# EAGLE design TDR-head (EAGLE 9.5.0)
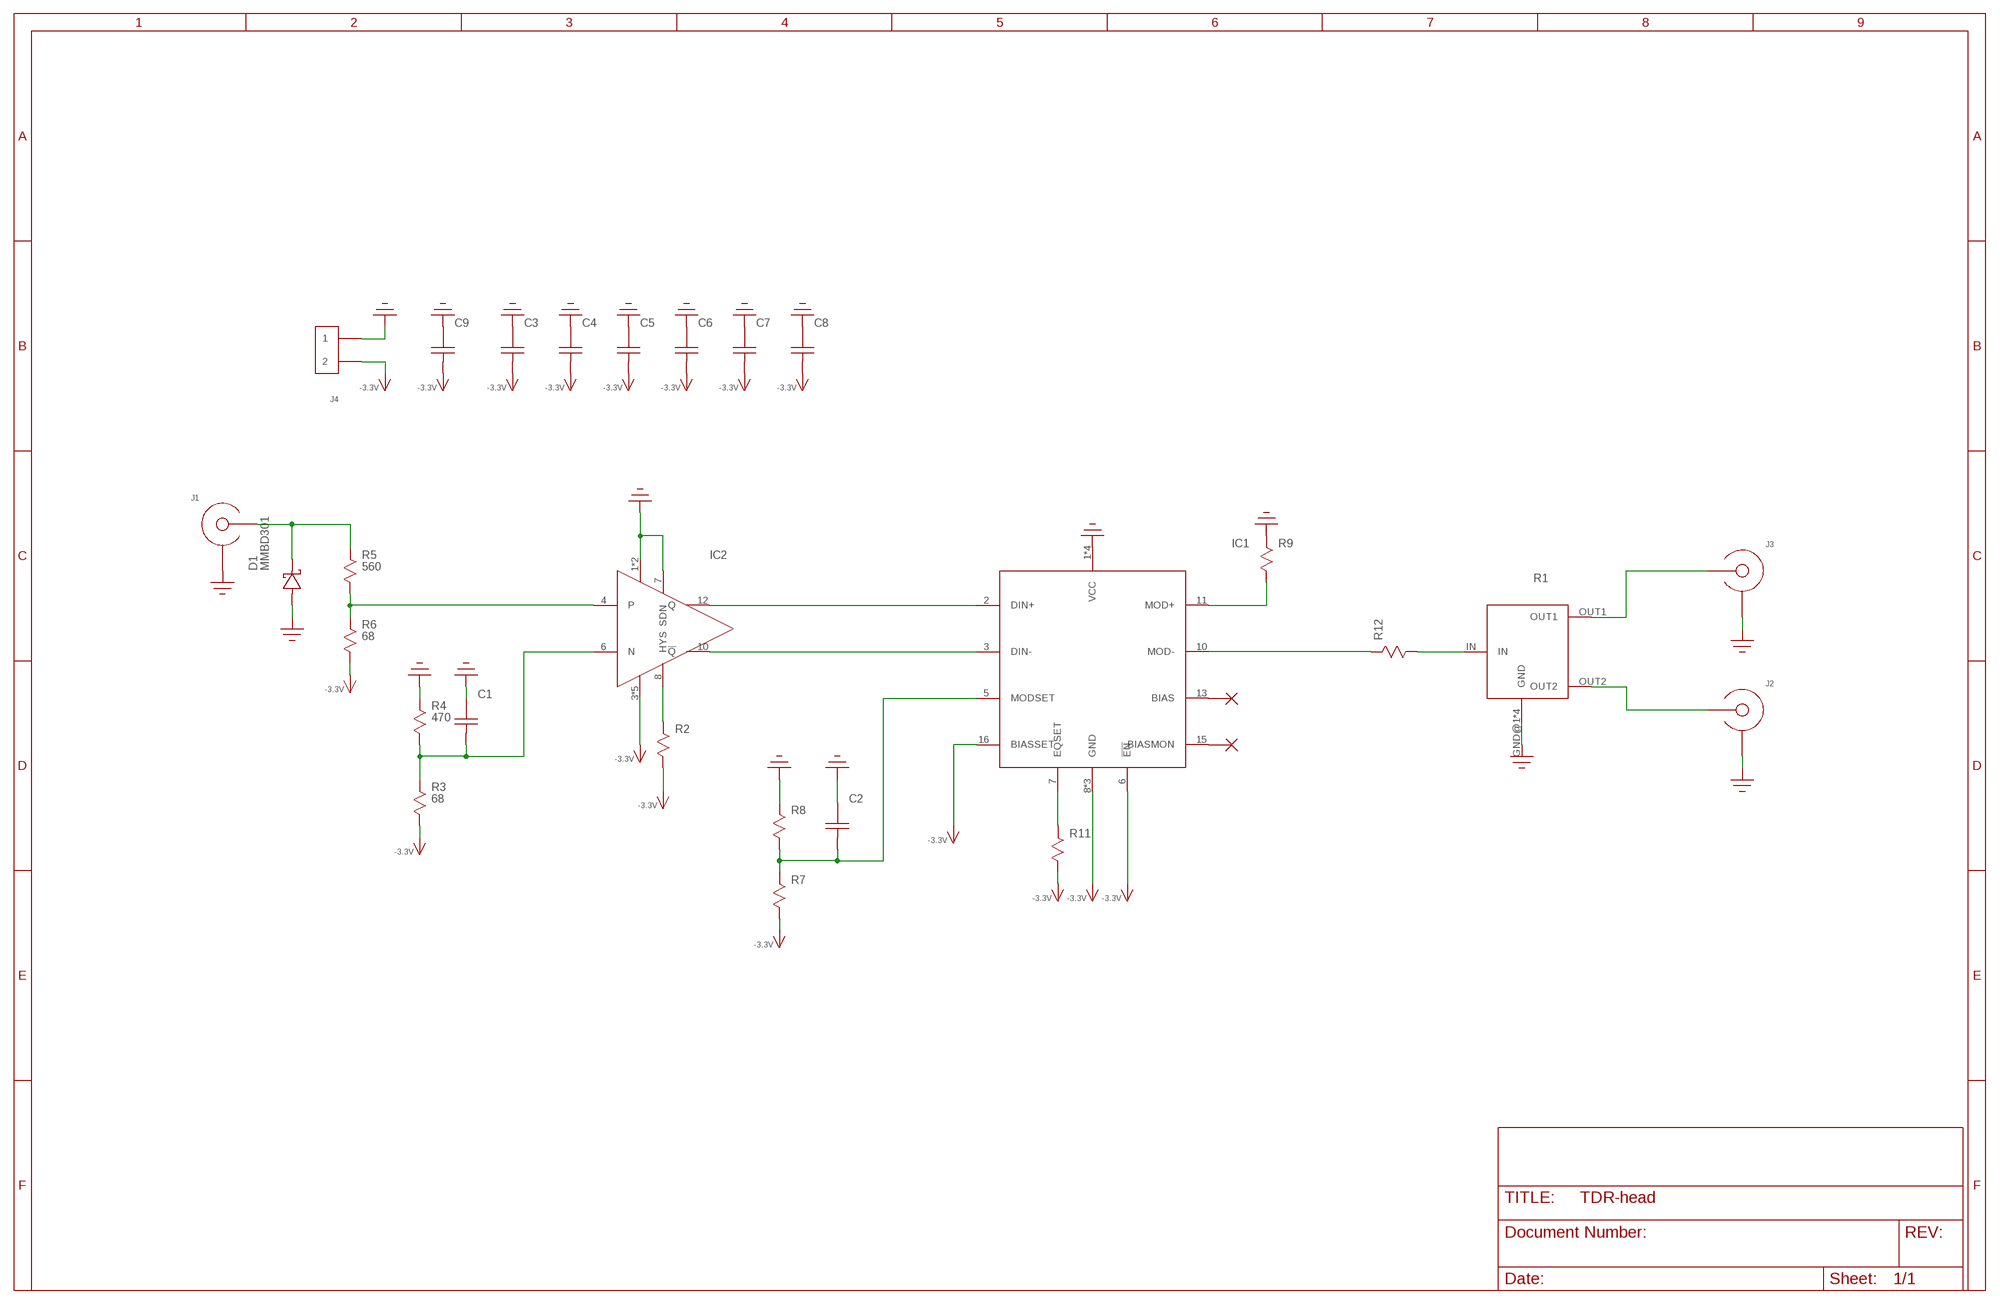
[diagram p0: schematic, sheet 1]

## Parts
C1  C0603  [C0603]
C2  C0603  [C0603]
C3  C  [C0402]
C4  C  [C0402]
C5  C  [C0402]
C6  C  [C0402]
C7  C  [C0402]
C8  C  [C0402]
C9  C1206  [1206]
D1  MMBD301  SCHOTTKYSOT-23  [SOT-23]
IC1  SY88022AL  [TQFN16-EP]
IC2  ADCMP607  [QFN12-3X3]
J1  SMA-EDGE-LAUNCH4020N5  [SMA_EDGE_LAUNCH_4L_4020_N5]
J2  SMA-EDGE-LAUNCH4020N5  [SMA_EDGE_LAUNCH_4L_4020_N5]
J3  SMA-EDGE-LAUNCH4020N5  [SMA_EDGE_LAUNCH_4L_4020_N5]
J4  HEADER_2PIN  [HEADER_2PIN]
R1  PS2012G-SPLITTER  [PS2012G-SPLITTER]
R2  R0603  [R0603]
R3  68  R0603  [R0603]
R4  470  R0603  [R0603]
R5  560  R0603  [R0603]
R6  68  R0603  [R0603]
R7  R0603  [R0603]
R8  R0603  [R0603]
R9  R0402  [0402]
R11  R0603  [R0603]
R12  R0402  [0402]
U$19  NO_CONNECT  (no package)
U$20  NO_CONNECT  (no package)

## Nets
-3.3V: C3.1 C4.1 C5.1 C6.1 C7.1 C8.1 C9.P$1 IC1.6(!EN!) IC1.8(GND) IC1.14(GND) IC1.16(BIASSET) IC1.EP(GND) IC2.3(VEE) IC2.5(VEE) IC2.9(VEE) IC2.11(VEE) IC2.EP(VEE) J4.2 R2.P$2 R3.P$2 R6.P$2 R7.P$2 R11.P$2
GND: C1.P$2 C2.P$2 C3.2 C4.2 C5.2 C6.2 C7.2 C8.2 C9.P$2 D1.1(ANODE) IC1.1(VCC) IC1.4(VCC) IC1.9(VCC) IC1.12(VCC) IC2.1(VCC) IC2.2(VCC) IC2.7(SDN) J1.BOTTOM_GND(SHIELD) J1.GND@1(SHIELD) J1.GND@2(SHIELD) J1.GND@3(SHIELD) J1.GND@4(SHIELD) J1.GND@5(SHIELD) J1.GND@6(SHIELD) J1.GND@7(SHIELD) J1.GND@8(SHIELD) J1.GND@9(SHIELD) J1.GND@10(SHIELD) J1.GND@14(SHIELD) J1.GND@15(SHIELD) J1.GND@16(SHIELD) J1.GND@17(SHIELD) J1.GND_PAD1(SHIELD) J1.GND_PAD2(SHIELD) J1.P$1(SHIELD) J1.P$2(SHIELD) J1.P$3(SHIELD) J1.P$4(SHIELD) J1.P$5(SHIELD) J2.BOTTOM_GND(SHIELD) J2.GND@1(SHIELD) J2.GND@2(SHIELD) J2.GND@3(SHIELD) J2.GND@4(SHIELD) J2.GND@5(SHIELD) J2.GND@6(SHIELD) J2.GND@7(SHIELD) J2.GND@8(SHIELD) J2.GND@9(SHIELD) J2.GND@10(SHIELD) J2.GND@14(SHIELD) J2.GND@15(SHIELD) J2.GND@16(SHIELD) J2.GND@17(SHIELD) J2.GND_PAD1(SHIELD) J2.GND_PAD2(SHIELD) J2.P$1(SHIELD) J2.P$2(SHIELD) J2.P$3(SHIELD) J2.P$4(SHIELD) J2.P$5(SHIELD) J3.BOTTOM_GND(SHIELD) J3.GND@1(SHIELD) J3.GND@2(SHIELD) J3.GND@3(SHIELD) J3.GND@4(SHIELD) J3.GND@5(SHIELD) J3.GND@6(SHIELD) J3.GND@7(SHIELD) J3.GND@8(SHIELD) J3.GND@9(SHIELD) J3.GND@10(SHIELD) J3.GND@14(SHIELD) J3.GND@15(SHIELD) J3.GND@16(SHIELD) J3.GND@17(SHIELD) J3.GND_PAD1(SHIELD) J3.GND_PAD2(SHIELD) J3.P$1(SHIELD) J3.P$2(SHIELD) J3.P$3(SHIELD) J3.P$4(SHIELD) J3.P$5(SHIELD) J4.1 R1.GND@1(GND) R1.GND@2(GND) R1.GND@3(GND) R1.GND@4(GND) R4.P$1 R8.P$1 R9.1
N$1: J2.CENTER@1(CENTER) J2.CENTER@2(CENTER) R1.OUT2
N$2: J3.CENTER@1(CENTER) J3.CENTER@2(CENTER) R1.OUT1
N$3: IC1.2(DIN+) IC2.12(Q)
N$4: IC1.3(DIN-) IC2.10(!Q!)
N$5: IC2.8(HYS) R2.P$1
N$6: C1.P$1 IC2.6(N) R3.P$1 R4.P$2
N$7 [13.4-6]: D1.3(CATHODE) J1.CENTER@1(CENTER) J1.CENTER@2(CENTER) R5.P$1
N$8 [13.4-6]: IC2.4(P) R5.P$2 R6.P$1
N$9: C2.P$1 IC1.5(MODSET) R7.P$1 R8.P$2
N$10 [13.4-6]: R1.IN R12.2
N$11: IC1.15(BIASMON) U$19.P$1
N$12: IC1.13(BIAS) U$20.P$1
N$13: IC1.11(MOD+) R9.2
N$14: IC1.7(EQSET) R11.P$1
N$15: IC1.10(MOD-) R12.1

## Library data of the parts
C1-C9 = yapo:C
D1 = yapo:SCHOTTKY
IC1 = yapo:SY88022AL
IC2 = yapo:ADCMP607
J1-J3 = sma-temp:SMA-EDGE-LAUNCH
J4 = yapo:HEADER_2PIN
R1 = yapo:PS2012G-SPLITTER
R2-R9 R11 R12 = yapo:R
U$19 U$20 = yapo:NO_CONNECT

## Net classes
1 13.4-6: width 0.34 mm, clearance 0.152 mm

## Board
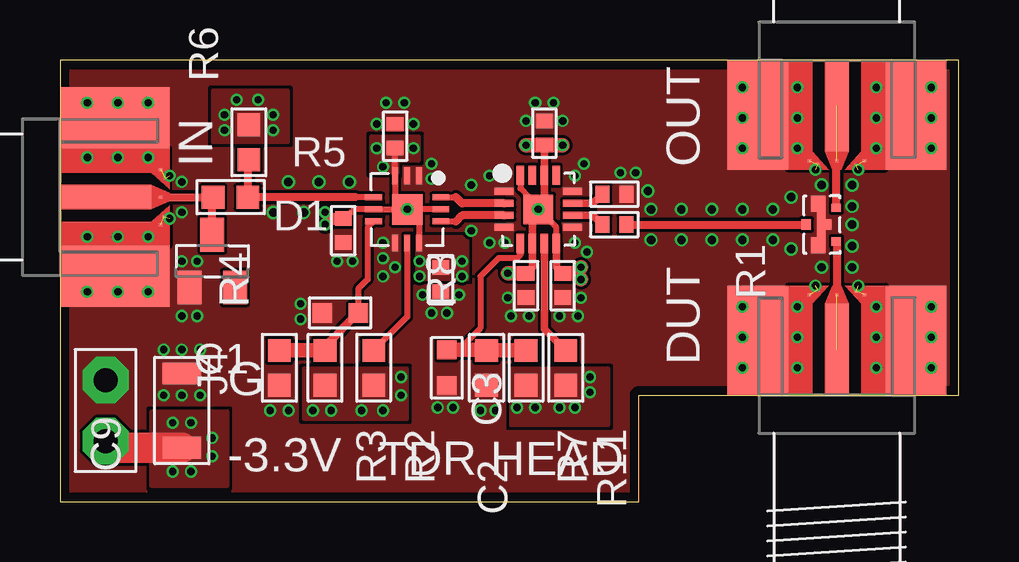
[diagram p1: board, top side]
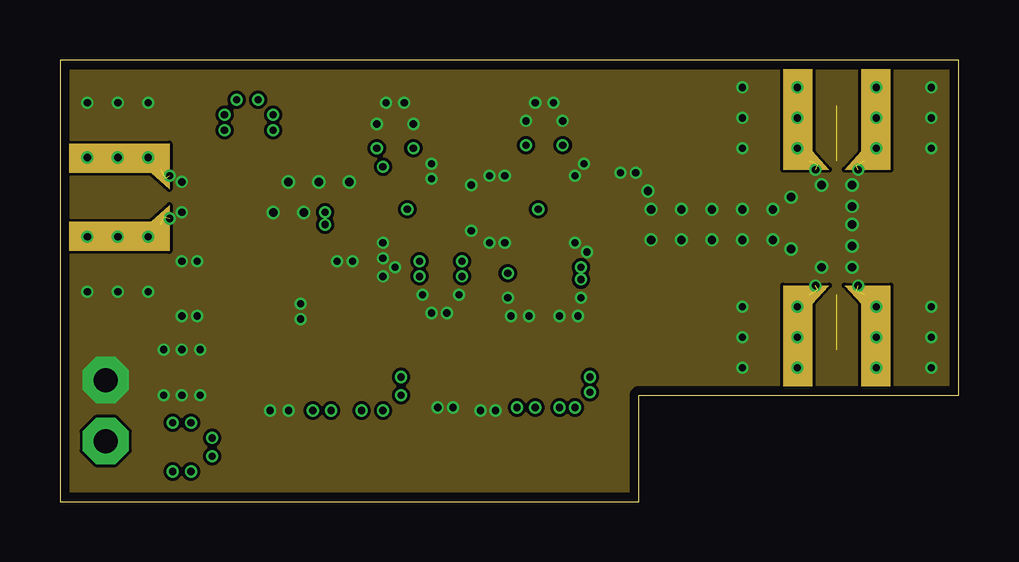
[diagram p2: board, inner layer Route2]
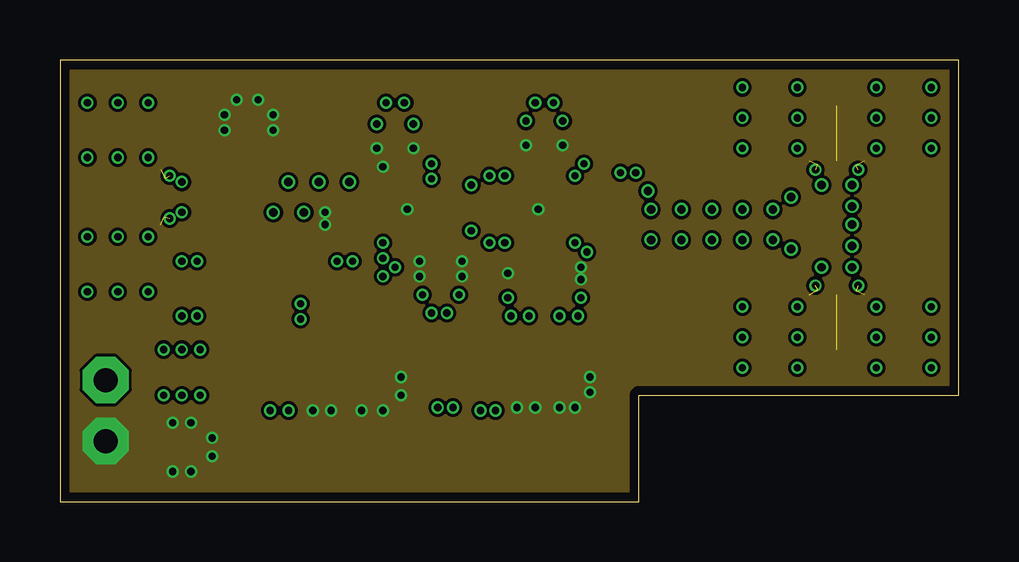
[diagram p3: board, inner layer Route15]
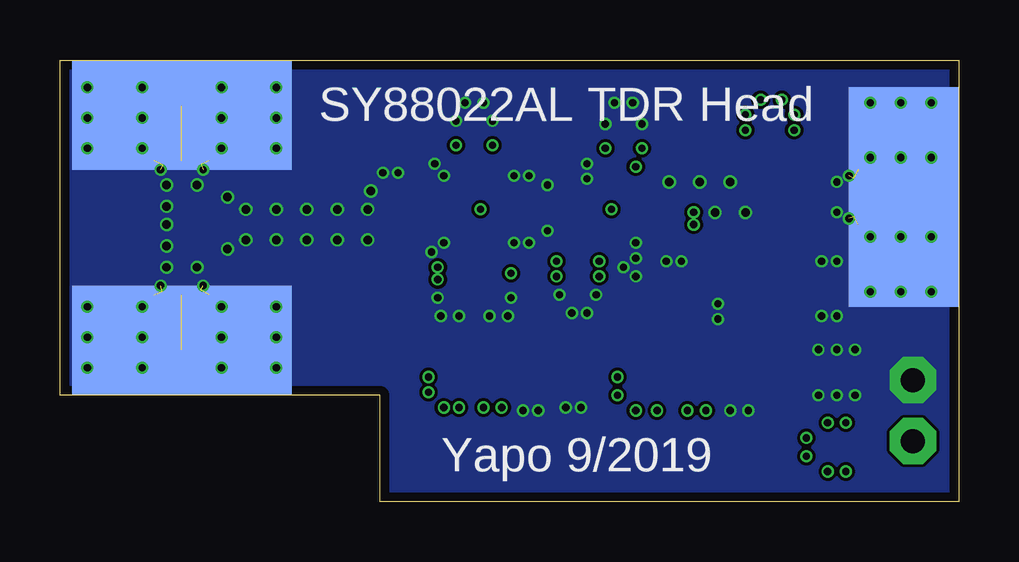
[diagram p4: board, bottom side, seen from below]

Size 37.47 x 18.41 mm. Coordinates in mm from the lower left corner, seen from the top.
Outline: 0,0 24.13,0 24.13,4.45 37.47,4.45 37.47,18.41 0,18.41 0,0
Copper layers (1*2*15*16): Top 0.035559375mm / dielectric 0.17018125mm / Route2 0.01778125mm / dielectric 47mil / Route15 0.01778125mm / dielectric 0.17018125mm / Bottom 0.035559375mm
Design rules "oshpark-4layer *": minimum track width 5mil, minimum drill 10mil, track to track 5mil, track to pad 5mil, pad to pad 5mil, via to via 5mil, smd to smd 5mil, copper to edge 15mil, drill to drill 6mil, minimum pad ring 4mil, minimum via ring 4mil, stop-mask expansion 2.5mil, vias tented up to drill 20mil, thermal gap 10mil

### Footprints (pad centres in the part's own frame; a part is rotated, then mirrored left to right if it is on the bottom)
C0603 = smd 0.8 x 0.8: P$1 -0.75,0; P$2 0.75,0
C0402 = smd 0.6 x 0.7: 1 -0.5,0; 2 0.5,0
1206 = smd 0.9 x 1.6: P$1 -1.55,0; P$2 1.55,0
SOT-23 = smd 1 x 1.4: 1 -0.95,-1.1; 2 0.95,-1.1; 3 0,1.1
TQFN16-EP = smd 0.3 x 0.8: 1 -0.75,-1.425; 2 -0.25,-1.425; 3 0.25,-1.425; 4 0.75,-1.425; 9 0.75,1.425; 10 0.25,1.425; 11 -0.25,1.425; 12 -0.75,1.425 | smd 0.8 x 0.3: 5 1.425,-0.75; 6 1.425,-0.25; 7 1.425,0.25; 8 1.425,0.75; 13 -1.425,0.75; 14 -1.425,0.25; 15 -1.425,-0.25; 16 -1.425,-0.75 | smd 1.23 x 1.23: EP 0,0
QFN12-3X3 = smd 0.7 x 0.25: 1 -1.4,0.5; 2 -1.4,0; 3 -1.4,-0.5; 7 1.4,-0.5; 8 1.4,0; 9 1.4,0.5 | smd 0.25 x 0.7: 4 -0.5,-1.4; 5 0,-1.4; 6 0.5,-1.4; 10 0.5,1.4; 11 0,1.4; 12 -0.5,1.4 | smd 1.27 x 1.27: EP 0,0
SMA_EDGE_LAUNCH_4L_4020_N5 = smd 4.572 x 9.144 bottom: BOTTOM_GND 2.286,0 | smd 3.81 x 1.016: CENTER@1 1.905,0 | smd 0.127 x 0.127: CENTER@2 4.191,0; P$1 4.191,1.143; P$2 4.191,-1.143; P$3 4.191,1.143; P$4 4.394,0.787; P$5 4.343,-0.813 | drill 0.3: GND@1 1.143,3.937; GND@2 3.683,3.937; GND@3 1.143,1.651; GND@4 3.683,1.651; GND@5 1.143,-1.651; GND@6 3.683,-1.651; GND@7 1.143,-3.937; GND@8 3.683,-3.937; GND@9 4.572,0.889; GND@10 4.572,-0.889; GND@14 2.413,3.937; GND@15 2.413,-3.937; GND@16 2.413,-1.651; GND@17 2.413,1.651 | smd 4.572 x 2.54: GND_PAD1 2.286,3.302; GND_PAD2 2.286,-3.302
HEADER_2PIN = drill 1 pad 1.93 octagon: 1 -1.27,0; 2 1.27,0
PS2012G-SPLITTER = smd 0.675 x 0.6: GND@1 -0.863,-0.7; GND@3 0.863,-0.7 | smd 1.05 x 0.35: GND@2 0,-0.825 | smd 0.45 x 0.25: GND@4 0,-1.125 | smd 0.45 x 0.4: IN 0,-0.2 | smd 0.35 x 0.4: OUT1 -0.7,-1.45; OUT2 0.7,-1.45
R0603 = smd 0.95 x 0.95: P$1 -0.725,0; P$2 0.725,0
0402 = smd 0.6 x 0.7: 1 -0.5,0; 2 0.5,0

### Placement (x,y rotation side)
C1  11.68,7.87 180 top
C2  16.13,5.59 270 top
C3  15.88,9.26 270 top
C4  13.97,15.24 90 top
C5  11.81,11.3 270 top
C6  20.19,15.37 90 top
C7  19.43,9.02 270 top
C8  20.95,9.02 270 top
C9  5.08,3.81 90 top
D1  6.35,10.03 0 top
IC1  19.94,12.19 270 top
IC2  14.48,12.19 270 top
J1  0,12.7 0 top
J2  32.38,18.41 270 top
J3  32.38,4.45 90 top
J4  1.91,3.81 270 top
R1  30.91,11.56 90 top
R2  13.08,5.59 270 top
R3  11.05,5.59 270 top
R4  9.14,5.59 90 top
R5  7.11,12.7 0 top
R6  7.87,14.99 90 top
R7  19.43,5.59 270 top
R8  17.78,5.59 90 top
R9  23.11,12.83 180 top
R11  21.08,5.59 270 top
R12  23.11,11.56 0 top

### Tracks (layer width: path | path; a pad name or v marks a point on that pad's centre or on a via)
-3.3V  (via drill 0.3)
  Top 0.254: C5.1 12.31,12.19 IC2.5 13.97,12.19 | C4.1 IC2.3 13.98,12.2 13.97,12.19 | 13.97,12.19 IC2.EP | IC2.11 IC2.EP | IC2.9 14.98,11.93 14.74,11.93 IC2.EP | IC1.16 19.19,13.07 19.56,12.7 19.56,12.57 IC1.EP | IC1.EP 19.75,12 | IC1.8 20.69,11.44 IC1.EP
  Top 0.305: IC1.EP 20.19,12.44 IC1.14 C6.1 | 19.75,12 19.69,11.94 IC1.6 19.69,9.78 C7.1 | IC1.8 20.69,9.78 C8.1
  Top 0.508: v11.05,12.06 11.31,11.8 C5.1 11.29,11.8 v11.05,11.56
  Top 0.61: v19.43,14.86 C6.1 20.2,14.86 v20.95,14.86 | v21.72,9.78 21.46,9.52 | 21.46,9.52 C8.1 | v21.72,9.27 21.47,9.52 21.46,9.52 | v18.67,9.53 C7.1
  Top 1.27: J4.2 2.19,2.26 C9.P$1
  other vias: 14.48,12.19 14.73,14.73 13.21,14.73 13.46,13.97 14.99,10.03 14.99,9.4 16.76,10.03 16.76,9.4 10.54,3.81 11.3,3.81 12.57,3.81 13.46,3.81 14.22,5.21 14.22,4.45 7.37,16.76 8.26,16.76 6.86,15.49 8.89,15.49 6.86,16.13 8.89,16.13 19.94,12.19 22.1,5.21 22.1,4.57 21.46,3.94 20.83,3.94 19.81,3.94 19.05,3.94 6.35,2.67 6.35,1.91 4.7,3.3 5.46,3.3 4.7,1.27 5.46,1.27
  pour Top (no thermals): 12.95,13.72 14.1,13.72 14.1,14.22 14.99,14.22 14.99,15.24 12.95,15.24
  pour Top (no thermals): 14.86,9.27 17.02,9.27 17.02,11.05 14.86,11.05
  pour Top (no thermals): 10.16,5.59 14.48,5.59 14.48,3.43 10.16,3.43
  pour Route15 (no thermals): 0,0 24.13,0 24.13,4.45 37.47,4.45 37.47,18.41 0,18.41
  pour Top (no thermals): 6.35,14.99 9.53,14.99 9.53,17.14 6.35,17.14
  pour Top (no thermals): 18.8,5.59 22.86,5.59 22.86,3.17 18.8,3.17
  pour Top (no thermals): 3.81,3.81 6.99,3.81 6.99,0.64 3.81,0.64
GND  (via drill 0.3, 0.35)  (12 unrouted)
  other vias: 11.56,10.03 12.19,10.03 15.49,7.87 16.13,7.87 16.64,8.64 15.11,8.64 13.46,10.79 13.46,10.16 15.49,13.46 15.49,14.1 14.73,15.75 13.21,15.75 13.59,16.64 14.35,16.64 5.08,7.75 5.71,7.75 5.08,10.03 5.71,10.03 5.08,12.06 5.08,13.34 10.03,7.62 10.03,8.26 9.53,3.81 8.76,3.81 9.53,13.34 10.79,13.34 10.16,12.06 8.89,12.06 12.06,13.34 13.97,9.78 13.46,9.4 18.54,13.59 18.54,10.79 17.91,13.59 17.91,10.79 17.14,13.21 17.14,11.3 18.16,3.81 17.53,3.81 16.38,3.94 15.75,3.94 21.46,13.59 21.46,10.79 21.84,14.1 21.97,10.41 19.56,7.75 20.83,7.75 21.59,7.75 21.72,8.51 18.8,7.75 18.67,8.51 23.37,13.72 24,13.72 24.64,12.19 24.64,10.92 29.72,10.92 29.72,12.19 33.02,13.21 31.75,13.21 33.02,9.78 31.75,9.78 33.02,12.32 33.02,10.67 30.48,12.7 30.48,10.54 24.51,12.95 25.91,12.19 27.18,12.19 28.45,12.19 25.91,10.92 27.18,10.92 28.45,10.92 20.57,16.64 19.81,16.64 19.43,15.88 20.95,15.88 4.32,6.35 5.08,6.35 5.84,6.35 5.08,4.45 4.32,4.45 5.84,4.45 33.02,11.56
  pour Top (rank 2, no thermals): 0,0 24.13,0 24.13,4.45 37.47,4.45 37.47,18.41 0,18.41
  pour Route2 (no thermals): 0,0 0,18.41 37.47,18.41 37.47,4.45 24.13,4.45 24.13,0
  pour Bottom (no thermals): 0,0 24.13,0 24.13,4.45 37.47,4.45 37.47,18.41 0,18.41
N$1  (2 unrouted)
  Top 0.34: R1.OUT2 32.36,15.85 32.38,15.88
N$2  (2 unrouted)
  Top 0.34: R1.OUT1 32.38,10.83 32.38,6.99
N$3
  Top 0.254: IC2.12 16.51,12.7
  Top 0.34: IC1.2 16.77,12.44 16.51,12.7
N$4
  Top 0.254: IC2.10 16.5,11.69 16.51,11.68
  Top 0.34: IC1.3 16.77,11.94 16.51,11.68
N$5
  Top 0.254: IC2.8 14.48,7.71 R2.P$1
N$6
  Top 0.254: IC2.6 12.83,11.44 12.83,9.27 12.43,8.88 C1.P$1
  Top 0.34: C1.P$1 11.05,6.49 R3.P$1
  Top 0.61: R4.P$2 R3.P$1
N$7
  Top 0.34: J1.CENTER@1 J1.CENTER@2 4.45,12.7 R5.P$1 6.35,12.66 D1.3
N$8
  Top 0.254: IC2.4 12.33,12.69 12.32,12.7
  Top 0.34: 12.32,12.7 R5.P$2 7.84,14.22 R6.P$1
N$9
  Top 0.254: IC1.5 19.19,10.3 19.05,10.16 18.29,10.16 17.53,9.4 17.53,7.24 16.62,6.34
  Top 0.61: R7.P$1 R8.P$2 17.75,6.34 C2.P$1 16.62,6.34
N$10
  Top 0.34: R12.2 R1.IN
N$13
  Top 0.305: IC1.11 22.23,12.44 R9.2
N$14
  Top 0.305: IC1.7 20.19,7.21 R11.P$1
N$15
  Top 0.305: IC1.10 22.23,11.94 R12.1

### Text on the board
tPlace: IN | OUT | DUT | G | TDR HEAD | -3.3V
bPlace: SY88022AL TDR Head | Yapo 9/2019